# EAGLE schematic REVB (EAGLE 8.7.1)
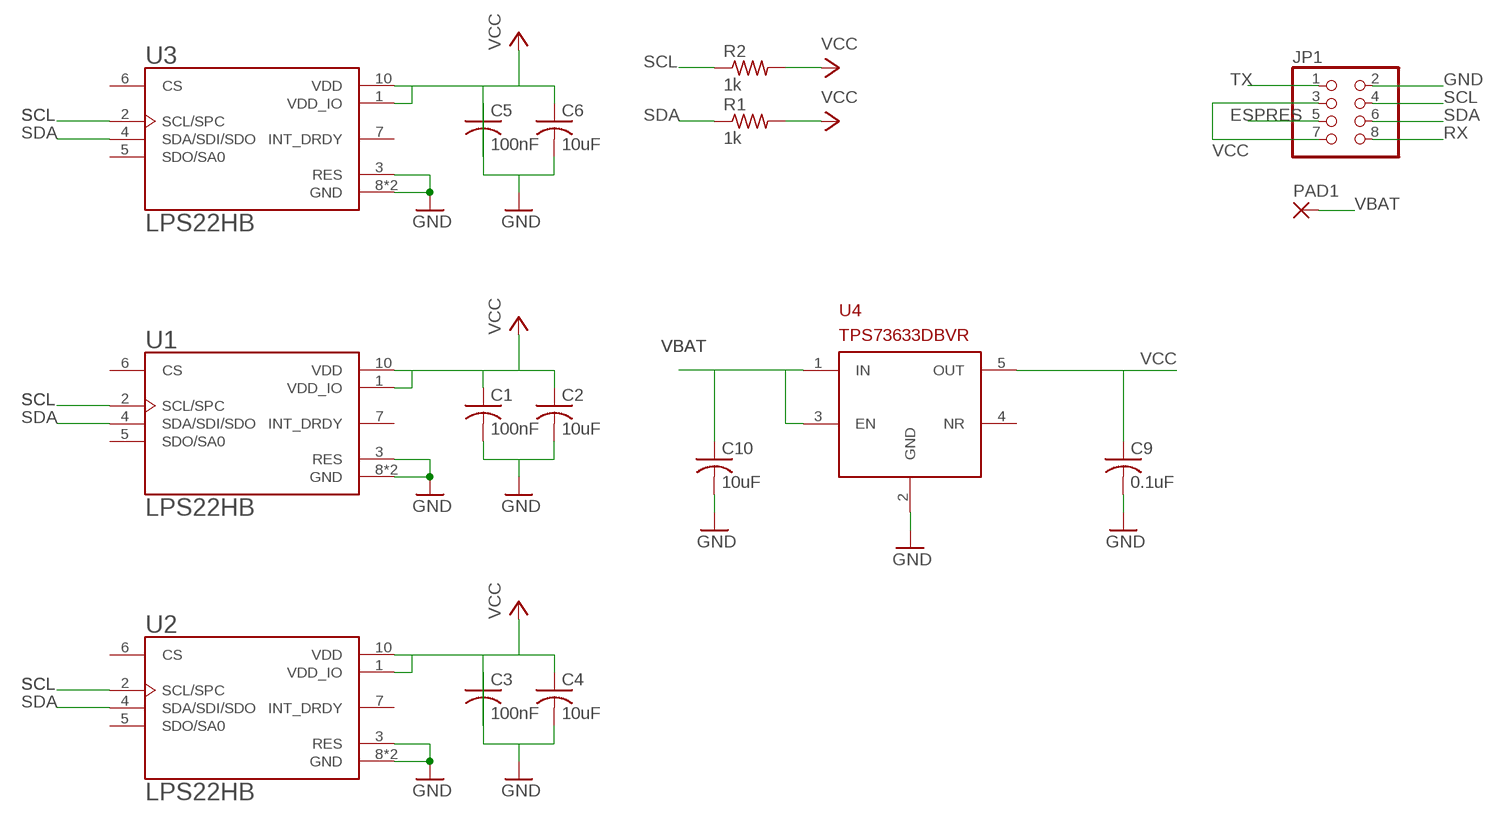
[diagram p0: schematic, sheet 1]

## Parts
C1  100nF  C-USC0402  [C0402]
C2  10uF  C-USC0402  [C0402]
C3  100nF  C-USC0402  [C0402]
C4  10uF  C-USC0402  [C0402]
C5  100nF  C-USC0402  [C0402]
C6  10uF  C-USC0402  [C0402]
C9  0.1uF  C-USC0402  [C0402]
C10  10uF  C-USC0402  [C0402]
JP1  PINHD-2X4/90  [2X04/90]
PAD1  2,15/1,0  [2,15/1,0]
R1  1k  R-US_R0402  [R0402]
R2  1k  R-US_R0402  [R0402]
U1  LPS22HB  [LGA10R50P2X3_200X200X80]
U2  LPS22HB  [LGA10R50P2X3_200X200X80]
U3  LPS22HB  [LGA10R50P2X3_200X200X80]
U4  TPS73633DBVR  [SOT23-DBV]

## Nets
ESPRES: JP1.5
GND: C1.2 C2.2 C3.1 C4.2 C5.1 C6.2 C9.2 C10.2 JP1.2 U1.3(RES) U1.8(GND) U1.9(GND) U2.3(RES) U2.8(GND) U2.9(GND) U3.3(RES) U3.8(GND) U3.9(GND) U4.2(GND)
RX: JP1.8
SCL: JP1.4 R2.1 U1.2(SCL/SPC) U2.2(SCL/SPC) U3.2(SCL/SPC)
SDA: JP1.6 R1.1 U1.4(SDA/SDI/SDO) U2.4(SDA/SDI/SDO) U3.4(SDA/SDI/SDO)
TX: JP1.1
VBAT: C10.1 PAD1.1(P) U4.1(IN) U4.3(EN)
VCC: C1.1 C2.1 C3.2 C4.1 C5.2 C6.1 C9.1 JP1.3 JP1.7 R1.2 R2.2 U1.1(VDD_IO) U1.10(VDD) U2.1(VDD_IO) U2.10(VDD) U3.1(VDD_IO) U3.10(VDD) U4.5(OUT)
Unconnected: U1.5(SDO/SA0) U1.6(CS) U1.7(INT_DRDY) U2.5(SDO/SA0) U2.6(CS) U2.7(INT_DRDY) U3.5(SDO/SA0) U3.6(CS) U3.7(INT_DRDY) U4.4(NR)

## Library data of the parts
C1-C6 C9 C10 = rcl:C-US: CAPACITOR, American symbol; SPICEPREFIX: C
JP1 = pinhead:PINHD-2X4: PIN HEADER
PAD1 = wirepad:2,15/1,0: THROUGH-HOLE PAD
R1 R2 = rcl:R-US_: RESISTOR, American symbol; SPICEPREFIX: R
U1-U3 = LPS22HB:LPS22HB: MEMS nano pressure sensor: 260-1260 hPa absolute digital output barometer; AVAILABILITY: Unavailable; DESCRIPTION: MEMS nano pressure sensor: 260-1260 hPa absolute digital output barometer; MF: STMicroelectronics; MP: LPS22HB; PACKAGE: None; PRICE: None
U4 = TPS73633DBVR:TPS73633DBVR: 3.3V LDO regulator. Package footprint not verified!!; AVAILABILITY: Good; DESCRIPTION: Single Output LDO, 400mA, Adj._1.2 to 5.5V_, Cap free, Low Noise, Reverse Current Protection 5-SOT-23 -40 to 125; MF: Texas Instruments; MP: TPS73633DBVR; PACKAGE: SOT-23 Texas Instruments; PRICE: 1.20 USD